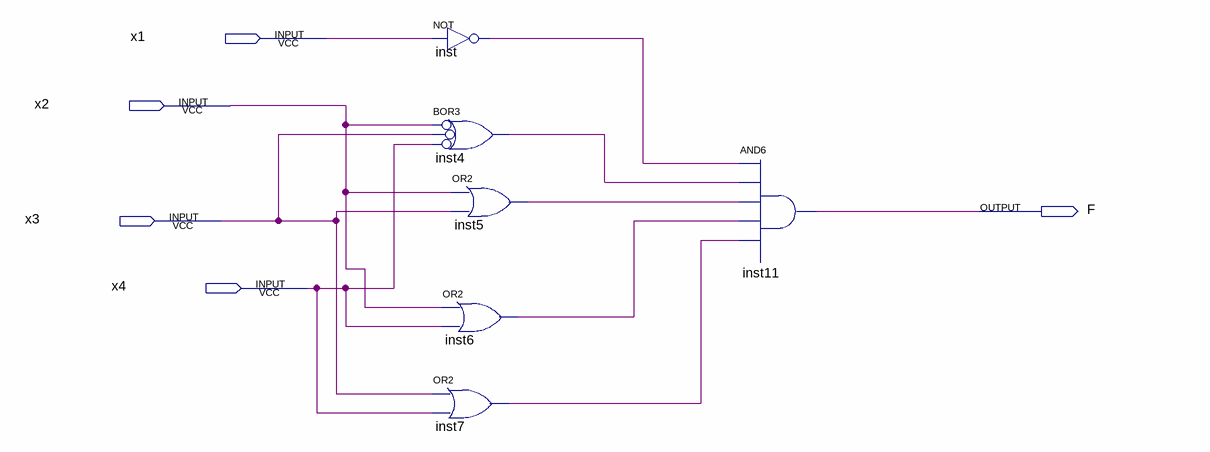
[diagram p0: schematic sheet]
// Quartus schematic problem2.bdf as structural Verilog: 6 symbols, 5 pins
module problem2 (
  input  x1,
  input  x2,
  input  x3,
  input  x4,
  output F
);

  wire inst4_out, inst5_out, inst6_out, inst7_out, inst_out;

  not inst (inst_out, x1);
  or inst4 (inst4_out, ~x2, ~x3, ~x4);  // BOR3
  or inst5 (inst5_out, x2, x3);
  or inst6 (inst6_out, x2, x4);
  or inst7 (inst7_out, x3, x4);
  and inst11 (F, inst_out, inst4_out, inst5_out, inst6_out, inst7_out);  // open: IN6, IN6, IN6
endmodule
